# Altium schematic sheet MIPI.SchDoc
size A3; SheetNumber: 13; SheetTotal: 13
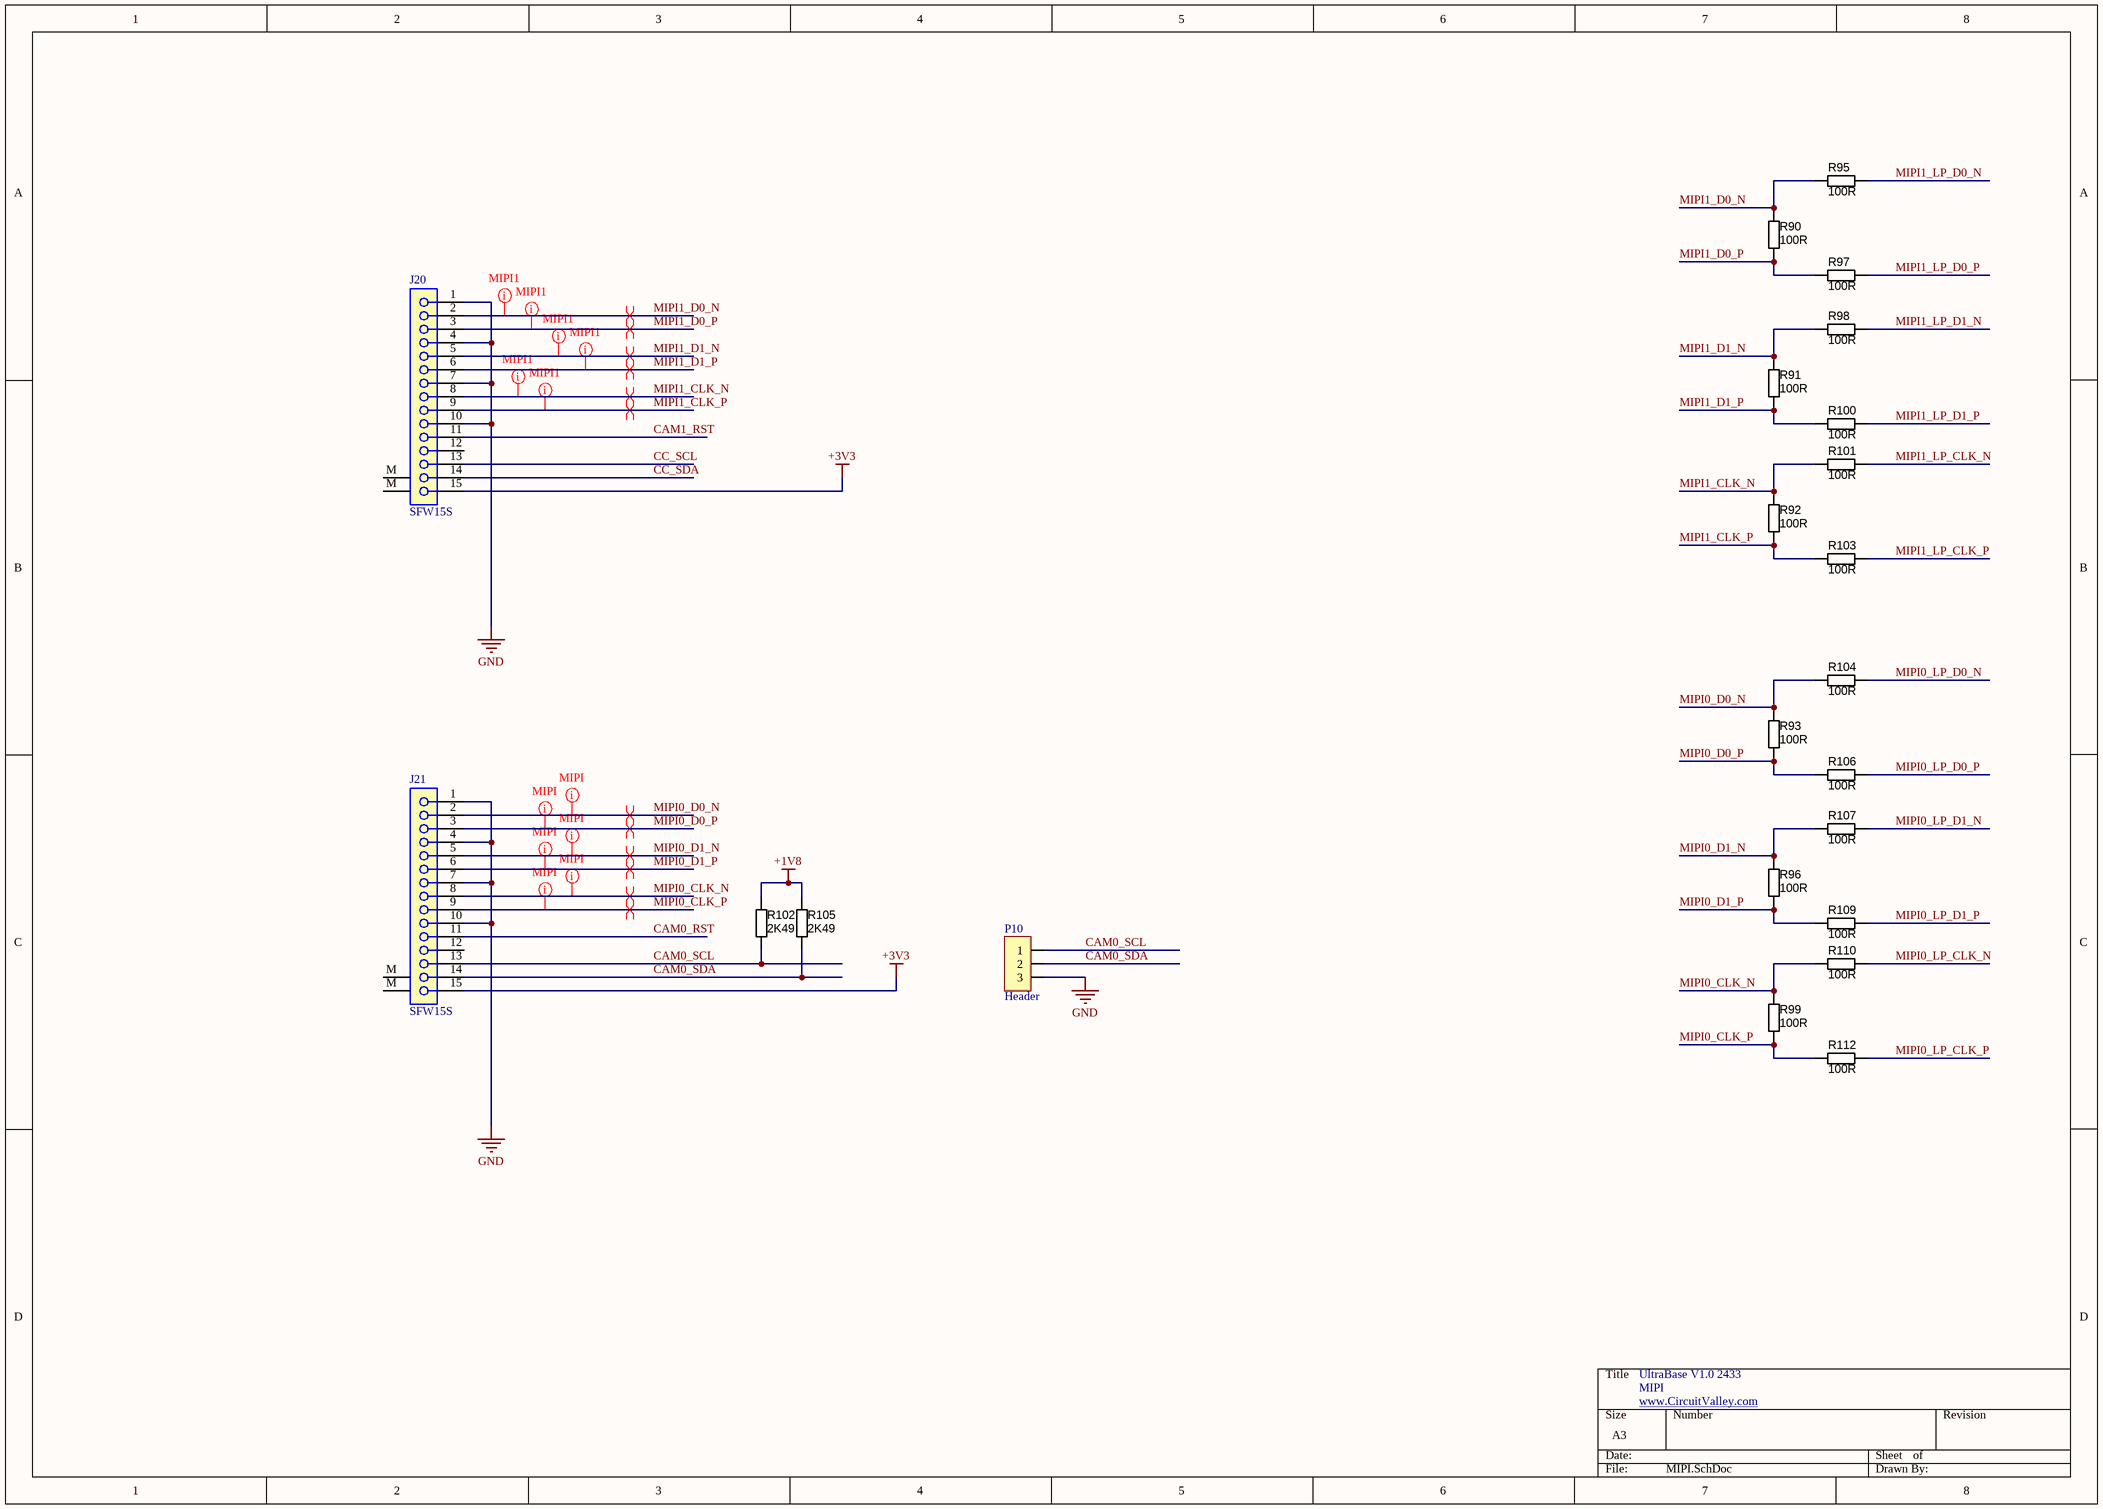
[diagram p0: MIPI.SchDoc]

## Parts
J20  SFW15S  [SFW15S-2STMAE1LF]
J21  SFW15S  [SFW15S-2STMAE1LF]
P10  Header  [Header3x]
R90  value 100R  [RESC1005N]  (hidden comment: Thick Film)
R91  value 100R  [RESC1005N]  (hidden comment: Thick Film)
R92  value 100R  [RESC1005N]  (hidden comment: Thick Film)
R93  value 100R  [RESC1005N]  (hidden comment: Thick Film)
R95  value 100R  [RESC1608N]  (hidden comment: RES_NL_0603)
R96  value 100R  [RESC1005N]  (hidden comment: Thick Film)
R97  value 100R  [RESC1608N]  (hidden comment: RES_NL_0603)
R98  value 100R  [RESC1608N]  (hidden comment: RES_NL_0603)
R99  value 100R  [RESC1005N]  (hidden comment: Thick Film)
R100  value 100R  [RESC1608N]  (hidden comment: RES_NL_0603)
R101  value 100R  [RESC1608N]  (hidden comment: RES_NL_0603)
R102  value 2K49  [RESC1608N]  (hidden comment: RES_NL_0603)
R103  value 100R  [RESC1608N]  (hidden comment: RES_NL_0603)
R104  value 100R  [RESC1608N]  (hidden comment: RES_NL_0603)
R105  value 2K49  [RESC1608N]  (hidden comment: RES_NL_0603)
R106  value 100R  [RESC1608N]  (hidden comment: RES_NL_0603)
R107  value 100R  [RESC1608N]  (hidden comment: RES_NL_0603)
R109  value 100R  [RESC1608N]  (hidden comment: RES_NL_0603)
R110  value 100R  [RESC1608N]  (hidden comment: RES_NL_0603)
R112  value 100R  [RESC1608N]  (hidden comment: RES_NL_0603)

## Nets
+1V8: R102.2 R105.2
+3V3: J20.15 J21.15
GND: J20.1 J20.4 J20.7 J20.10 J21.1 J21.4 J21.7 J21.10 P10.3
CAM0_RST: J21.11
CAM0_SCL: J21.13 P10.1 R102.1
CAM0_SDA: J21.14 P10.2 R105.1
CAM1_RST: J20.11
CC_SCL: J20.13
CC_SDA: J20.14
MIPI0_CLK_N: J21.8 R99.1 R110.1
MIPI0_CLK_P: J21.9 R99.2 R112.1
MIPI0_D0_N: J21.2 R93.1 R104.1
MIPI0_D0_P: J21.3 R93.2 R106.1
MIPI0_D1_N: J21.5 R96.1 R107.1
MIPI0_D1_P: J21.6 R96.2 R109.1
MIPI0_LP_CLK_N: R110.2
MIPI0_LP_CLK_P: R112.2
MIPI0_LP_D0_N: R104.2
MIPI0_LP_D0_P: R106.2
MIPI0_LP_D1_N: R107.2
MIPI0_LP_D1_P: R109.2
MIPI1_CLK_N: J20.8 R92.1 R101.1
MIPI1_CLK_P: J20.9 R92.2 R103.1
MIPI1_D0_N: J20.2 R90.1 R95.1
MIPI1_D0_P: J20.3 R90.2 R97.1
MIPI1_D1_N: J20.5 R91.1 R98.1
MIPI1_D1_P: J20.6 R91.2 R100.1
MIPI1_LP_CLK_N: R101.2
MIPI1_LP_CLK_P: R103.2
MIPI1_LP_D0_N: R95.2
MIPI1_LP_D0_P: R97.2
MIPI1_LP_D1_N: R98.2
MIPI1_LP_D1_P: R100.2

Not connected (* = marked no-connect by the designer): J20 12 M(16); J21 12 M(16)

## Layout directives
differential pair: MIPI0_CLK_N, MIPI0_CLK_P, MIPI0_D0_N, MIPI0_D0_P, MIPI0_D1_N, MIPI0_D1_P, MIPI1_CLK_N, MIPI1_CLK_P, MIPI1_D0_N, MIPI1_D0_P, MIPI1_D1_N, MIPI1_D1_P
net class MIPI1: MIPI1_CLK_N, MIPI1_CLK_P, MIPI1_D0_N, MIPI1_D0_P, MIPI1_D1_N, MIPI1_D1_P
net class MIPI: MIPI0_CLK_N, MIPI0_CLK_P, MIPI0_D0_N, MIPI0_D0_P, MIPI0_D1_N, MIPI0_D1_P

## Notes on the sheet
- UltraBase V1.0 2433
- MIPI
- www.CircuitValley.com <http://www.CircuitValley.com>

## Library data of the parts
J20 J21 = SFW15S: 15 pin 1mm FPC, RPI Camera
P10 = Header_3Pin: 3 Pin Header
R90-R93 R96 R99 = RES_3K3_0402_5%: Resistor SMD chip 3.3k Ohm 0.063W 5% 0402; Manufacturer 1: Yageo; Manufacturer Part Number 1: RC0402JR-073K3L; Ratings: 1/16 W; Package / Case: 0402 (1005 metric); Tolerance: ±5%; Material: Thick Film; Supplier 1: Digi-Key; Supplier Part Number 1: 311-3.3KJRCT-ND; ComponentLink1URL: http://www.yageo.com/documents/recent/PYu-RC0402_51_RoHS_L_6.pdf; ComponentLink1Description: http://www.yageo.com/documents/recent/PYu-RC0402_51_RoHS_L_6.pdf
R95 R97 R98 R100-R107 R109 R110 R112 = RES_NL_0603: Resistor, SMD chip; Manufacturer 1: Royal Ohm; Ratings: 1/10 W; Tolerance: ±5%; Package / Case: 0603 (1608 metric)